# EAGLE design pi433_r01 (EAGLE 7.7.0)
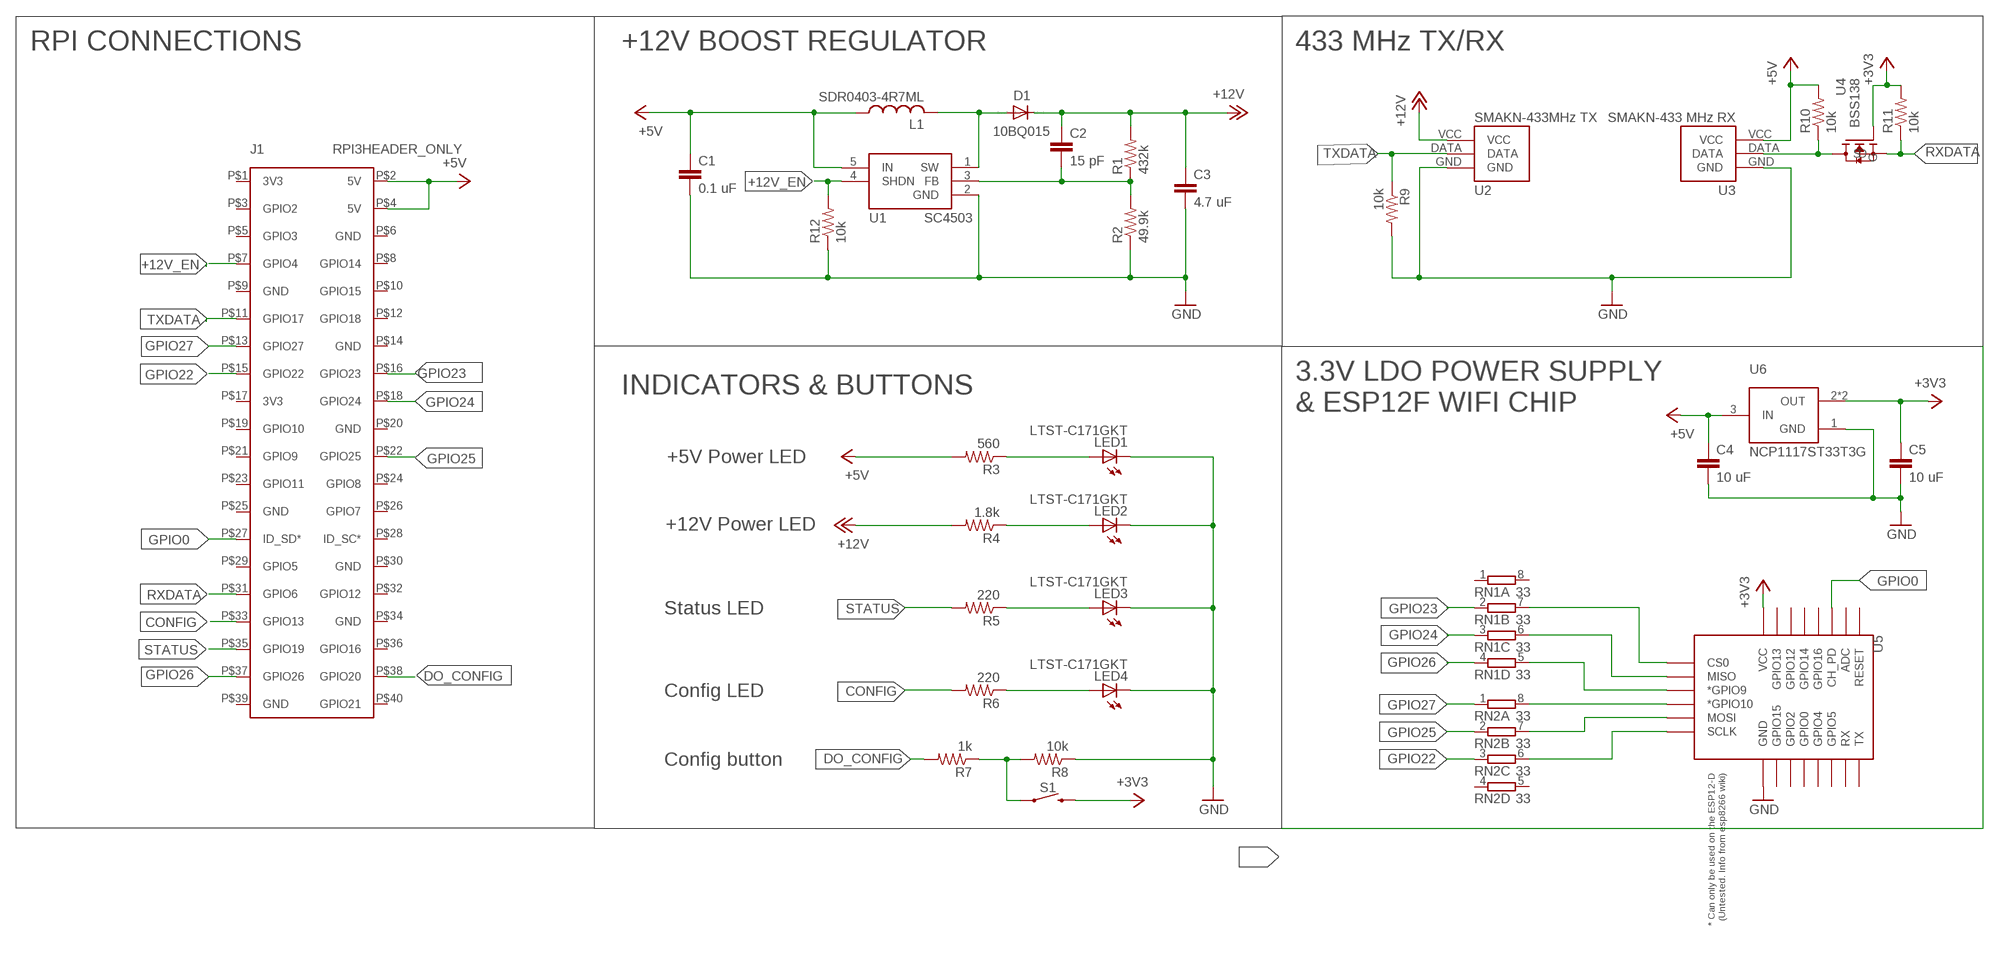
[diagram p0: schematic, sheet 1]

## Parts
C1  0.1 uF  C-EUC0603  [C0603]
C2  15 pF  C-EUC0603  [C0603]
C3  4.7 uF  C-EUC0805  [C0805]
C4  10 uF  C-EUC0805  [C0805]
C5  10 uF  C-EUC0805  [C0805]
D1  10BQ015  DIODE-DO214AA  [DO214AA]
J1  RPI3HEADER_ONLY  [RPI3-HEADER_ONLY]
L1  SDR0403-4R7ML  [SDR0403]
LED1  LTST-C171GKT  LEDCHIPLED_0805  [CHIPLED_0805]
LED2  LTST-C171GKT  LEDCHIPLED_0805  [CHIPLED_0805]
LED3  LTST-C171GKT  LEDCHIPLED_0805  [CHIPLED_0805]
LED4  LTST-C171GKT  LEDCHIPLED_0805  [CHIPLED_0805]
R1  432k  R-US_R0805  [R0805]
R2  49.9k  R-US_R0805  [R0805]
R3  560  R-US_R0805  [R0805]
R4  1.8k  R-US_R0805  [R0805]
R5  220  R-US_R0805  [R0805]
R6  220  R-US_R0805  [R0805]
R7  1k  R-US_R0805  [R0805]
R8  10k  R-US_R0805  [R0805]
R9  10k  R-US_R0805  [R0805]
R10  10k  R-US_R0805  [R0805]
R11  10k  R-US_R0805  [R0805]
R12  10k  R-US_R0805  [R0805]
RN1  33  4R-NCAY16  [CAY16]
RN2  33  4R-NCAY16  [CAY16]
S1  MOMENTARY-SWITCH-SPST-SMD-6.0X3.5MM  [TACTILE_SWITCH_SMD_6.0X3.5MM]
U1  SC4503  [TSOT-23-5]
U2  SMAKN-433TX  [SMAKN-433TX]
U3  SMAKN-433RX  [SMAKN-433RX]
U4  BSS138  [BSS138]
U5  ESP12ESMD  [ESP12E-SMD]
U6  NCP1117ST33T3G  [SOT230P700X180-4N]

## Nets
+3V3: C5.1 R11.2 S1.2 U4.G U5.VCC U6.2(OUT) U6.4(OUT)
+5V: C1.1 C4.1 J1.P$2(5V) J1.P$4(5V) L1.P$1 R3.2 R10.2 U1.5(IN) U3.VCC U6.3(IN)
+12V: C2.1 C3.1 D1.C R1.2 R4.2 U2.VCC
+12V_EN: J1.P$7(GPIO4) R12.2 U1.4(SHDN)
CONFIG: J1.P$33(GPIO13) R6.2
DO_CONFIG: J1.P$38(GPIO20) R7.2
GND: C1.2 C3.2 C4.2 C5.2 LED1.C LED2.C LED3.C LED4.C R2.1 R8.1 R9.2 R12.1 U1.2(GND) U2.GND U3.GND U5.GND U6.1(GND)
GPIO0: J1.P$27(ID_SD*) U5.CH_PD
GPIO22: J1.P$15(GPIO22) RN2.3
GPIO23: J1.P$16(GPIO23) RN1.2
GPIO24: J1.P$18(GPIO24) RN1.3
GPIO25: J1.P$22(GPIO25) RN2.2
GPIO26: J1.P$37(GPIO26) RN1.4
GPIO27: J1.P$13(GPIO27) RN2.1
N$1: LED1.A R3.1
N$2: D1.A L1.P$2 U1.1(SW)
N$3: LED2.A R4.1
N$4: LED3.A R5.1
N$5: C2.2 R1.1 R2.2 U1.3(FB)
N$6: LED4.A R6.1
N$7: R7.1 R8.2 S1.1
N$9: RN1.7 U5.CS0
N$10: RN1.6 U5.MISO
N$11: RN1.5 U5.GPIO9(*GPIO9)
N$12: R10.1 U3.DATA U4.D
N$13: RN2.8 U5.GPIO10(*GPIO10)
N$14: RN2.7 U5.MOSI
N$15: RN2.6 U5.SCLK
RXDATA: J1.P$31(GPIO6) R11.1 U4.S
STATUS: J1.P$35(GPIO19) R5.2
TXDATA: J1.P$11(GPIO17) R9.1 U2.DATA
Unconnected: J1.P$1(3V3) J1.P$3(GPIO2) J1.P$5(GPIO3) J1.P$6(GND) J1.P$8(GPIO14) J1.P$9(GND) J1.P$10(GPIO15) J1.P$12(GPIO18) J1.P$14(GND) J1.P$17(3V3) J1.P$19(GPIO10) J1.P$20(GND) J1.P$21(GPIO9) J1.P$23(GPIO11) J1.P$24(GPIO8) J1.P$25(GND) J1.P$26(GPIO7) J1.P$28(ID_SC*) J1.P$29(GPIO5) J1.P$30(GND) J1.P$32(GPIO12) J1.P$34(GND) J1.P$36(GPIO16) J1.P$39(GND) J1.P$40(GPIO21) RN1.1 RN1.8 RN2.4 RN2.5 U5.ADC U5.GPIO0 U5.GPIO2 U5.GPIO4 U5.GPIO5 U5.GPIO12 U5.GPIO13 U5.GPIO14 U5.GPIO15 U5.GPIO16 U5.RESET U5.RXD0(RX) U5.TXD0(TX)

## Notes on the sheet
- RPI CONNECTIONS | +12V BOOST REGULATOR | 433 MHz TX/RX
- 3.3V LDO POWER SUPPLY
  & ESP12F WIFI CHIP
- INDICATORS & BUTTONS
- +5V Power LED
- +12V Power LED
- Status LED
- Config LED
- Config button

## Library data of the parts
C1-C5 = rcl:C-EU: CAPACITOR, European symbol
D1 = diode:DIODE-: DIODE
J1 = pi433:RPI3: Device for Raspberry Pi 3 board created by Dave Young for www.element14.com More information and support community is available at https://www.element14.com/community/community/raspberry-pi
L1 = pi433:SDR0403-4R7ML: 4.7 uH inductor (replacement for rec. CDC5D23B-4R7 from datasheet)
LED1-LED4 = led:LED: LED OSRAM: - CHIPLED LG R971, LG N971, LY N971, LG Q971, LY Q971, LO R971, LY R971 LH N974, LH R974 LS Q976, LO Q976, LY Q976 LO Q996 - Hyper CHIPLED LW Q18S LB Q993, LB Q99A, LB R99A - SideLED LS A670, LO A670, LY A670, LG A670, LP A670 LB A673, LV A673, LT A673, LW A673 LH A674 LY A675 LS A676, LA A676, LO A676, LY A676, LW A676 LS A679, LY A679, LG A679 - Hyper Micro SIDELED® LS Y876, LA Y876, LO Y876, LY Y876 LT Y87S - SmartLED LW L88C, LW L88S LB L89C, LB L89S, LG L890 LS L89K, LO L89K, LY L89K LS L896, LA L896, LO L896, LY L896 - TOPLED LS T670, LO T670, LY T670, LG T670, LP T670 LSG T670, LSP T670, LSY T670, LOP T670, LYG T670 LG T671, LOG T671, LSG T671 LB T673, LV T673, LT T673, LW T673 LH T674 LS T676, LA T676, LO T676, LY T676, LB T676, LH T676, LSB T676, LW T676 LB T67C, LV T67C, LT T67C, LS T67K, LO T67K, LY T67K, LW E67C LS E67B, LA E67B, LO E67B, LY E67B, LB E67C, LV E67C, LT E67C LW T67C LS T679, LY T679, LG T679 LS T770, LO T770, LY T770, LG T770, LP T770 LB T773, LV T773, LT T773, LW T773 LH T774 LS E675, LA E675, LY E675, LS T675 LS T776, LA T776, LO T776, LY T776, LB T776 LHGB T686 LT T68C, LB T68C - Hyper Mini TOPLED® LB M676 - Mini TOPLED Santana® LG M470 LS M47K, LO M47K, LY M47K Source: http://www.osram.convergy.de LUXEON: - LUMILED® LXK2-PW12-R00, LXK2-PW12-S00, LXK2-PW14-U00, LXK2-PW14-V00 LXK2-PM12-R00, LXK2-PM12-S00, LXK2-PM14-U00 LXK2-PE12-Q00, LXK2-PE12-R00, LXK2-PE12-S00, LXK2-PE14-T00, LXK2-PE14-U00 LXK2-PB12-K00, LXK2-PB12-L00, LXK2-PB12-M00, LXK2-PB14-N00, LXK2-PB14-P00, LXK2-PB14-Q00 LXK2-PR12-L00, LXK2-PR12-M00, LXK2-PR14-Q00, LXK2-PR14-R00 LXK2-PD12-Q00, LXK2-PD12-R00, LXK2-PD12-S00 LXK2-PH12-R00, LXK2-PH12-S00 LXK2-PL12-P00, LXK2-PL12-Q00, LXK2-PL12-R00 Source: www.luxeon.com KINGBRIGHT: KA-3528ASYC Source: www.kingbright.com
R1-R12 = rcl:R-US_: RESISTOR, American symbol
RN1 RN2 = resistor-dil:4R-N: Array Chip Resistor Source: RS Component / Phycomp; OC_FARNELL: unknown; OC_NEWARK: unknown
S1 = SparkFun-Switches:MOMENTARY-SWITCH-SPST: Momentary Switch (Pushbutton) - SPST Normally-open (NO) SPST momentary switches (buttons, pushbuttons). Variants PTH-12MM - 12mm square, through-hole Momentary Pushbutton Switch - 12mm Square <https://www.sparkfun.com/products/9190> (COM-09190) PTH-6.0MM, PTH-6.0MM-KIT - 6.0mm square, through-hole Mini Pushbutton Switch <https://www.sparkfun.com/products/97> (COM-00097) KIT package intended for soldering kit's - only one side of pads' copper is exposed. PTH-RIGHT-ANGLE-KIT - Right-angle, through-hole Right Angle Tactile Button <https://www.sparkfun.com/products/10791> - Used on SparkFun BigTime Watch Kit <https://www.sparkfun.com/products/11734> SMD-12MM - 12mm square, surface-mount Tactile Button - SMD (12mm) <https://www.sparkfun.com/products/12993> (COM-12993) Used on SparkFun PicoBoard <https://www.sparkfun.com/products/11888> SMD-4.5MM - 4.5mm Square Trackball Switch Used on SparkFun Blackberry Trackballer Breakout <https://www.sparkfun.com/products/13169> SMD-4.6MMX2.8MM - 4.60mm x 2.80mm, surface mount Used on SparkFun SAMD21 Mini Breakout <https://www.sparkfun.com/products/13664> SMD-5.2MM, SMD-5.2-REDUNDANT - 5.2mm square, surface-mount Mini Pushbutton Switch - SMD <https://www.sparkfun.com/products/8720> (COM-08720) Used on Arduino Pro Mini <https://www.sparkfun.com/products/11114> REDUNDANT package connects both switch circuits together SMD-6.0X3.5MM - 6.0 x 3.5mm, surface mount Momentary Reset Switch SMD <https://www.sparkfun.com/products/8229> (COM-08229) SMD-6.2MM-TALL - 6.2mm square, surface mount Tactile Button - SMD (6mm) <https://www.sparkfun.com/products/12992> Used on SparkFun Digital Sandbox <https://www.sparkfun.com/products/12651> SMD-RIGHT-ANGLE - Right-angle, surface mount Used on SparkFun Block for Intel® Edison - Arduino <https://www.sparkfun.com/products/13036>; PROD_ID: SWCH-00815; SF_SKU: COM-08229
U1 = pi433:SC4503
U2 = pi433:SMAKN-433TX: SMAKN 433 Mhz RF Transmitter https://www.amazon.com/SMAKN%C2%AE-433Mhz-Transmitter-Receiver-Arduino/dp/B00M2CUALS
U3 = pi433:SMAKN-433RX: SMAKN 433 Mhz RF Receiver https://www.amazon.com/SMAKN%C2%AE-433Mhz-Transmitter-Receiver-Arduino/dp/B00M2CUALS
U4 = BSS138:BSS138: BSS138 N-Channel Logic Level Enhancement Mode Field Effect Transistor; AVAILABILITY: Good; DESCRIPTION: B138 Series 50 V 6 Ohms N-Ch Logic Level Enhancement Mode FET - SOT-23-3; MF: Fairchild Semiconductor; MP: BSS138; PACKAGE: SOT-23-3 Fairchild Semiconductor; PRICE: 0.09 USD
U5 = pi433:ESP12E: ESP12E Module
U6 = pi433:NCP1117ST33T3G: 1.0 A Low-Dropout Positive ,Fixed and Adjustable,Voltage Regulators; AVAILABILITY: Good; DESCRIPTION: 1.0 A Positive LDO Linear Voltage Regulator (Fixed and Adjustable) Vout: 3.3 V; MF: ON Semiconductor; MP: NCP1117ST33T3G; PACKAGE: SOT-223 ON Semiconductor; PRICE: 0.23 USD

## Board
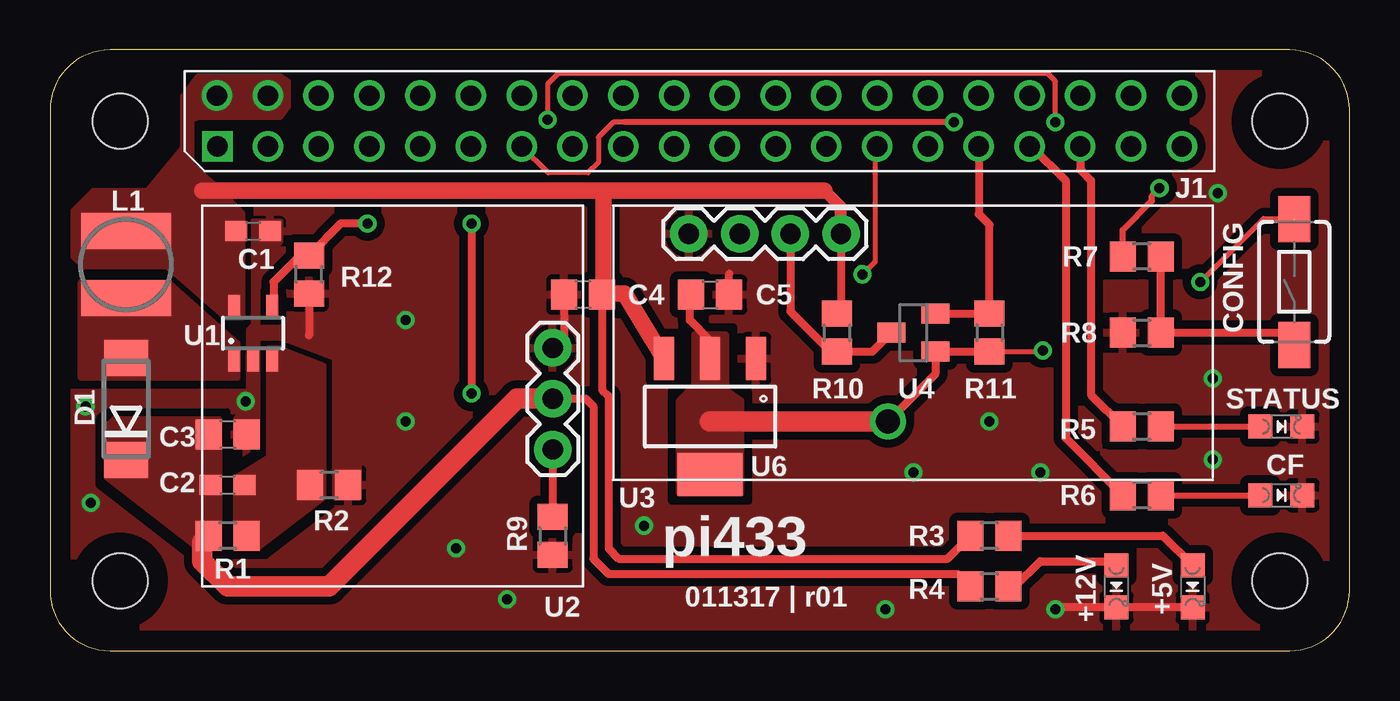
[diagram p1: board, top side]
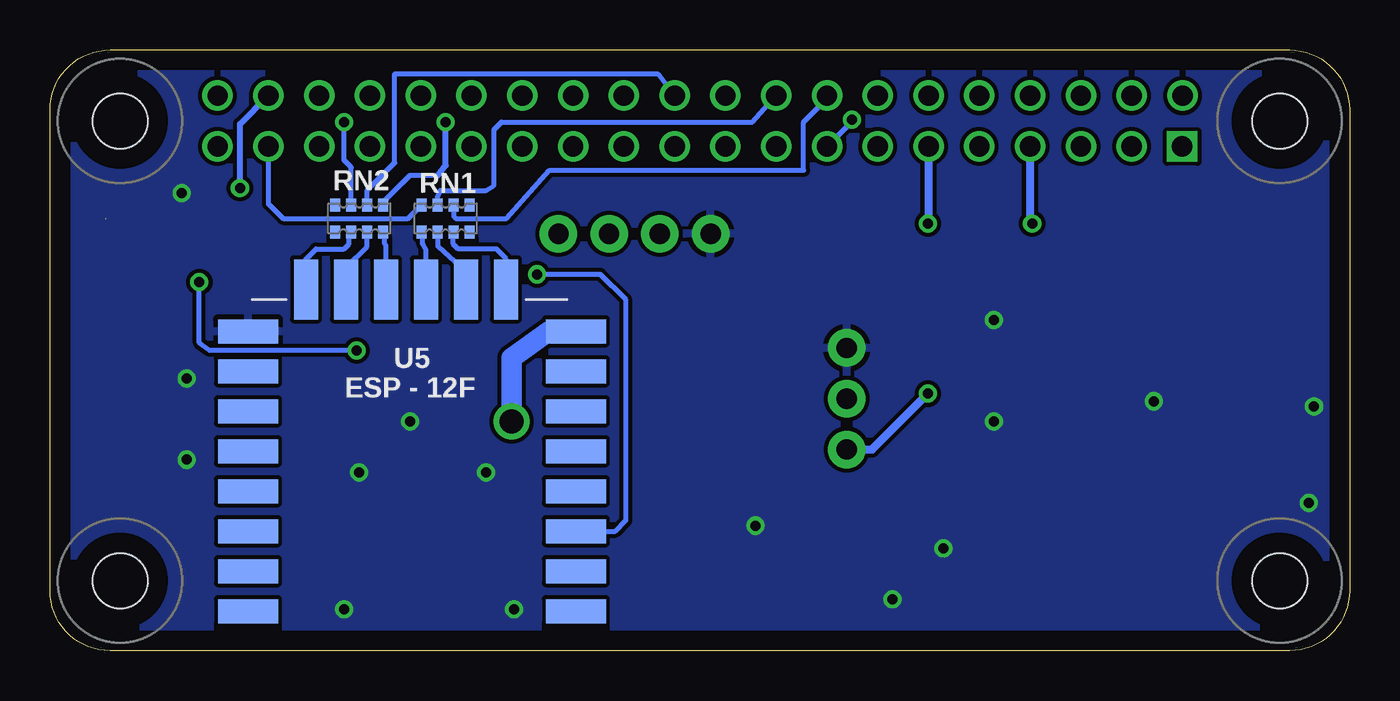
[diagram p2: board, bottom side, seen from below]

Size 65 x 30.06 mm. Coordinates in mm from the lower left corner, seen from the top.
Outline: 65,3 65,27.06 arc90 62,30.06 3,30.06 arc90 0,27.06 0,3 arc90 3,0 62,0 arc90 65,3
Copper layers (1*16): Top 0.035mm / dielectric 1.5mm / Bottom 0.035mm
Design rules "default *": minimum track width 10mil, minimum drill 0.3mm, track to track 8mil, track to pad 8mil, pad to pad 8mil, via to via 8mil, smd to smd 8mil, copper to edge 40mil, drill to drill 8mil, minimum pad ring 10mil, minimum via ring 8mil, stop-mask expansion 4mil, vias tented up to drill 0mil, thermal gap 10mil
Holes 2.75 mm at 3.5,3.5 61.5,3.5 3.5,26.5 61.5,26.5

### Footprints (pad centres in the part's own frame; a part is rotated, then mirrored left to right if it is on the bottom)
C0603 = smd 1.1 x 1: 1 -0.85,0; 2 0.85,0
C0805 = smd 1.3 x 1.5: 1 -0.95,0; 2 0.95,0
DO214AA = smd 1.8 x 2.2: A 2.55,0; C -2.55,0
RPI3-HEADER_ONLY = drill 1.016 square: P$1 2.02,2.97 | drill 1.016: P$2 2.007,5.512; P$3 4.547,2.972; P$4 4.547,5.512; P$5 7.087,2.972; P$6 7.087,5.512; P$7 9.627,2.972; P$8 9.627,5.512; P$9 12.167,2.972; P$10 12.167,5.512; P$11 14.707,2.972; P$12 14.707,5.512; P$13 17.247,2.972; P$14 17.247,5.512; P$15 19.787,2.972; P$16 19.787,5.512; P$17 22.327,2.972; P$18 22.327,5.512; P$19 24.867,2.972; P$20 24.867,5.512; P$21 27.407,2.972; P$22 27.407,5.512; P$23 29.947,2.972; P$24 29.947,5.512; P$25 32.487,2.972; P$26 32.487,5.512; P$27 35.027,2.972; P$28 35.027,5.512; P$29 37.567,2.972; P$30 37.567,5.512; P$31 40.107,2.972; P$32 40.107,5.512; P$33 42.647,2.972; P$34 42.647,5.512; P$35 45.187,2.972; P$36 45.187,5.512; P$37 47.727,2.972; P$38 47.727,5.512; P$39 50.267,2.972; P$40 50.267,5.512
SDR0403 = smd 4.5 x 1.8: P$1 2.54,1.27; P$2 2.54,4.61
CHIPLED_0805 = smd 1.2 x 1.2: A 0,-1.05; C 0,1.05
R0805 = smd 1.3 x 1.5: 1 -0.95,0; 2 0.95,0
CAY16 = smd 0.5 x 0.65: 1 -1.2,-0.675; 2 -0.4,-0.675; 3 0.4,-0.675; 4 1.2,-0.675; 5 1.2,0.675; 6 0.4,0.675; 7 -0.4,0.675; 8 -1.2,0.675
TACTILE_SWITCH_SMD_6.0X3.5MM = smd 2.3 x 1.6: 1 -3.15,0; 2 3.15,0
TSOT-23-5 = smd 0.62 x 1.22: 1 -0.95,-1.319; 2 0,-1.319; 3 0.95,-1.319; 4 0.95,1.281; 5 -0.95,1.281
SMAKN-433TX = drill 1.016 pad 1.88: DATA 6.858,1.524; GND 11.938,1.524; VCC 9.398,1.524
SMAKN-433RX = drill 1.016 pad 1.88: DATA 21.133,1.397; GND 26.213,1.397; NC 23.673,1.397; VCC 18.6,1.4
BSS138 = smd 1 x 1.4: D 0,1.1; G -0.95,-1.1; S 0.95,-1.1
ESP12E-SMD = smd 3 x 1.2: ADC -8.3,3.8; CH_PD -8.3,1.8; GND 8.1,-8.2; GPIO0 8.1,-2.2; GPIO2 8.1,-4.2; GPIO4 8.1,-0.2; GPIO5 8.1,1.8; GPIO12 -8.3,-4.2; GPIO13 -8.3,-6.2; GPIO14 -8.3,-2.2; GPIO15 8.1,-6.2; GPIO16 -8.3,-0.2; RESET -8.3,5.8; RXD0 8.1,3.8; TXD0 8.1,5.8; VCC -8.3,-8.2 | smd 1.2 x 3: CS0 -4.8,-10.3; GPIO9 -0.8,-10.3; GPIO10 1.2,-10.3; MISO -2.8,-10.3; MOSI 3.2,-10.3; SCLK 5.2,-10.3
SOT230P700X180-4N = smd 2.15 x 1: 1 -2.9,2.3; 2 -2.9,0; 3 -2.9,-2.3 | smd 2.15 x 3.25: 4 2.9,0

### Placement (x,y rotation side)
C1  10.16,20.99 0 top
C2  8.89,8.29 0 top
C3  8.89,10.83 0 top
C4  26.67,17.82 180 top
C5  33.02,17.82 0 top
D1  3.81,12.1 90 top
J1  6.35,22.26 0 top
L1  6.35,22.26 180 top
LED1  57.15,3.21 180 top
LED2  53.34,3.21 180 top
LED3  61.59,11.21 270 top
LED4  61.59,7.78 270 top
R1  8.89,5.75 180 top
R2  13.97,8.29 180 top
R3  46.99,5.75 180 top
R4  46.99,3.21 180 top
R5  54.61,11.21 180 top
R6  54.61,7.78 180 top
R7  54.61,19.72 180 top
R8  54.61,15.91 0 top
R9  25.15,5.75 270 top
R10  39.37,15.91 90 top
R11  46.99,15.91 270 top
R12  12.95,18.83 90 top
RN1  45.21,21.62 180 bottom
RN2  49.53,21.62 180 bottom
S1  62.23,18.45 90 top
U1  10.16,15.91 0 top
U2  26.67,3.21 90 top
U3  58.17,22.26 180 top
U4  43.18,15.91 90 top
U5  46.99,7.78 180 bottom
U6  33.02,11.72 270 top

### Tracks (layer width: path | path; a pad name or v marks a point on that pad's centre or on a via)
+3V3  (via drill 0.5, 1.2)  (1 unrouted)
  Top 0.254: R11.2 49.59,14.96 v49.66,15.02 | v57.53,18.45 60.71,21.62 62.2,21.62
  Top 0.406: R11.2 U4.G 44.28,13.84 v41.91,11.46 | U6.2 33.02,15.53 32,16.55 32,17.75 C5.1
  Top 1.016: v41.91,11.46 33.02,11.46
  Bottom 0.254: v49.66,15.02 57.02,15.02 57.53,15.4 v57.53,18.45
  Bottom 1.016: U5.VCC 40.06,15.98 41.91,14.64 v41.91,11.46
  pour Top (no thermals): 31.5,7.91 34.54,7.91 34.54,12.48 33.78,12.99 33.78,15.78 32.26,15.78 32.26,13.24 31.5,12.48
+5V
  Top 0.406: J1.P$4 10.9,28.08 | U3.VCC 39.57,17.06 R10.2 | C4.1 27.62,13.05 27.94,12.73 27.94,5.12 28.45,4.61 44.9,4.61 R3.2
  Top 0.61: U3.VCC 39.57,22.19 38.73,23.02
  Top 0.813: 38.73,23.02 27.68,23.02 | 27.68,23.02 7.62,23.02 | 27.68,23.02 27.68,17.88 | 27.68,17.88 C4.1 | 27.68,17.88 28.73,17.88 U6.3
  pour Top (no thermals): 7.49,26.71 11.56,26.71 11.94,27.21 11.94,28.48 11.56,28.74 7.37,28.74 6.6,27.72 6.6,25.18 4.83,23.02 2.16,23.02 1.14,22.01 1.14,19.72 1.65,19.21 5.84,19.21 8.76,16.67 9.65,16.67 9.65,21.88 9.02,22.51 9.02,22.64 7.11,24.29 7.11,26.58
+12V
  Top 0.406: U2.VCC 26.8,12.61 27.18,12.23 27.18,4.61 27.94,3.85 45.41,3.85 R4.2
  Top 1.016: U2.VCC 23.37,12.61 13.97,3.21 8.89,3.21 7.62,4.48 7.62,5.43 R1.2
  pour Top (no thermals): 8.51,11.59 3.17,11.59 2.79,11.21 2.79,8.67 7.37,5.12 8.51,5.12
+12V_EN  (via drill 0.5)
  Top 0.406: v15.88,21.37 14.54,21.37 R12.2 12.51,19.78 11.18,18.45 11.18,17.26 U1.4
  Bottom 0.406: J1.P$7 15.98,21.6 v15.88,21.37
CONFIG
  Top 0.406: J1.P$33 49.1,25.23 50.8,23.53 50.8,10.64 R6.2
DO_CONFIG  (via drill 0.5)
  Top 0.305: R7.2 53.66,21.06 55.12,22.51 55.12,22.77 v55.5,23.15
  Bottom 0.305: v55.5,23.15 55.5,26.35 J1.P$38
GND  (via drill 0.5)
  Top 0.305: LED4.C 62.74,7.78
  Top 0.406: 53.34,15.91 R8.1 53.72,15.97 | LED1.C LED2.C 50.38,2.16 v50.29,2.07 | R12.1 12.95,15.78 | C4.2 25.72,15.72 U2.GND | C5.2 33.97,18.85
  other vias: 41.78,2.07 58.17,9.56 58.17,13.62 17.78,11.46 20.32,5.12 43.18,8.93 49.53,8.93 46.99,11.46 29.72,6.26 17.78,16.55 22.86,2.58 58.42,22.89 2.03,7.4 1.78,12.23 9.78,12.48
  pour Bottom: 0,27 0,3 arc90 3,0 62,0 arc90 65,3 65,27 arc90 62,30 3,30 arc90
  pour Top (no thermals): 11.56,21.5 10.16,21.5 10.16,16.29 9.91,16.04 9.91,12.23 9.27,11.59 9.27,10.2 10.41,10.2 10.41,19.34 11.56,20.48
  pour Top (no thermals): 14.22,7.66 15.49,7.66 15.49,15.66 14.61,16.16 10.29,16.16 10.29,15.66 11.56,15.66 14.22,14.64
  pour Top (isolate 0.406, rank 2): 0,27 0,3 arc90 3,0 62,0 arc90 65,3 65,27 arc90 62,30 3,30 arc90
GPIO0  (via drill 0.5)
  Top 0.254: v40.64,18.83 41.27,19.47 41.27,25.13 J1.P$27
  Bottom 0.254: U5.CH_PD 36.73,5.98 36.2,6.51 36.2,17.56 37.47,18.83 v40.64,18.83
GPIO22  (via drill 0.5)
  Top 0.254: v50.29,26.45 50.29,28.48 49.91,28.86 25.4,28.86 24.89,28.36 v24.89,26.58
  Bottom 0.254: RN2.3 49.93,24.18 50.29,24.55 v50.29,26.45 | J1.P$15 24.89,26.48 v24.89,26.58
GPIO23
  Bottom 0.254: RN1.2 44.81,21.73 44.7,21.62 42.16,21.62 40.01,24.04 27.3,24.04 27.3,26.45 26.14,27.62 J1.P$16
GPIO24
  Bottom 0.254: RN1.3 45.61,22.75 45.47,23.02 43.18,23.02 42.8,23.28 42.8,26.07 42.42,26.45 29.87,26.45 J1.P$18
GPIO25
  Bottom 0.254: RN2.2 49.13,23.04 47.75,24.42 47.75,28.86 34.59,28.86 J1.P$22
GPIO26
  Bottom 0.254: J1.P$37 54.08,22.36 53.34,21.62 47.09,21.62 RN1.4
GPIO27  (via drill 0.5)
  Top 0.254: 28.73,26.45 28.19,26.45 27.43,25.69 27.43,24.42 26.92,23.91 24.92,23.91 J1.P$13
  Top 0.305: v45.21,26.45 28.73,26.45
  Bottom 0.254: 48.33,22.44 46.99,23.78 45.59,23.78
  Bottom 0.305: RN2.1 48.33,22.44 | 45.59,23.78 45.21,24.29 v45.21,26.45
N$1
  Top 0.406: R3.1 55.66,5.75 LED1.A
N$2
  pour Top (no thermals): 1.52,18.45 5.97,18.45 9.4,15.4 9.4,13.62 1.52,13.62
N$3
  Top 0.406: R4.1 48.26,3.21 49.53,4.48 53.12,4.48 LED2.A
N$4
  Top 0.305: R5.1 LED3.A
N$5
  pour Top (no thermals): 10.92,15.15 10.92,9.69 9.27,8.67 9.27,5.12 10.41,5.12 13.72,7.66 13.72,14.26 11.43,15.15
N$6
  Top 0.305: R6.1 LED4.A
N$7
  Top 0.406: S1.1 61.62,15.91 R8.2 R7.1
N$9
  Bottom 0.254: U5.CS0 42.19,19.62 42.67,20.1 44.58,20.1 44.83,20.36 44.83,20.84
  Bottom 0.305: 44.83,20.84 RN1.7
N$10
  Bottom 0.254: U5.MISO 44.19,18.95 45.59,20.23 45.59,20.8
  Bottom 0.305: 45.59,20.8 RN1.6
N$11
  Bottom 0.254: U5.GPIO9 46.19,20.06 46.35,20.36 46.35,20.88
  Bottom 0.305: 46.35,20.88 RN1.5
N$12
  Top 0.406: U4.D 41.13,14.96 R10.1 39.37,14.64 37.03,16.98 U3.DATA
N$13
  Bottom 0.254: U5.GPIO10 48.19,20.29 48.26,20.36 48.26,20.88
  Bottom 0.305: 48.26,20.88 RN2.8
N$14
  Bottom 0.254: U5.MOSI 50.19,19.19 49.15,20.23 49.15,20.93
  Bottom 0.305: 49.15,20.93 RN2.7
N$15
  Bottom 0.254: U5.SCLK 52.19,19.6 51.69,20.1 50.29,20.1 50.04,20.36 50.04,20.84 RN2.6
  Bottom 0.305: 49.91,20.93 RN2.6
RXDATA
  Top 0.406: J1.P$31 46.46,21.84 46.99,21.31 R11.1 U4.S
STATUS
  Top 0.406: J1.P$35 51.54,24.06 52.07,23.53 52.07,12.8 R5.2
TXDATA  (via drill 0.5)
  Top 0.406: U2.DATA R9.1 | v21.08,21.37 v21.08,12.86
  Bottom 0.406: J1.P$11 21.06,21.4 v21.08,21.37 | U2.DATA 23.88,10.07 v21.08,12.86

### Text on the board
tNames: CONFIG | U4 | STATUS | CF | pi433 | 011317 | r01 | +5V | +12V